# Altium project STAC_PCB.PrjPcb
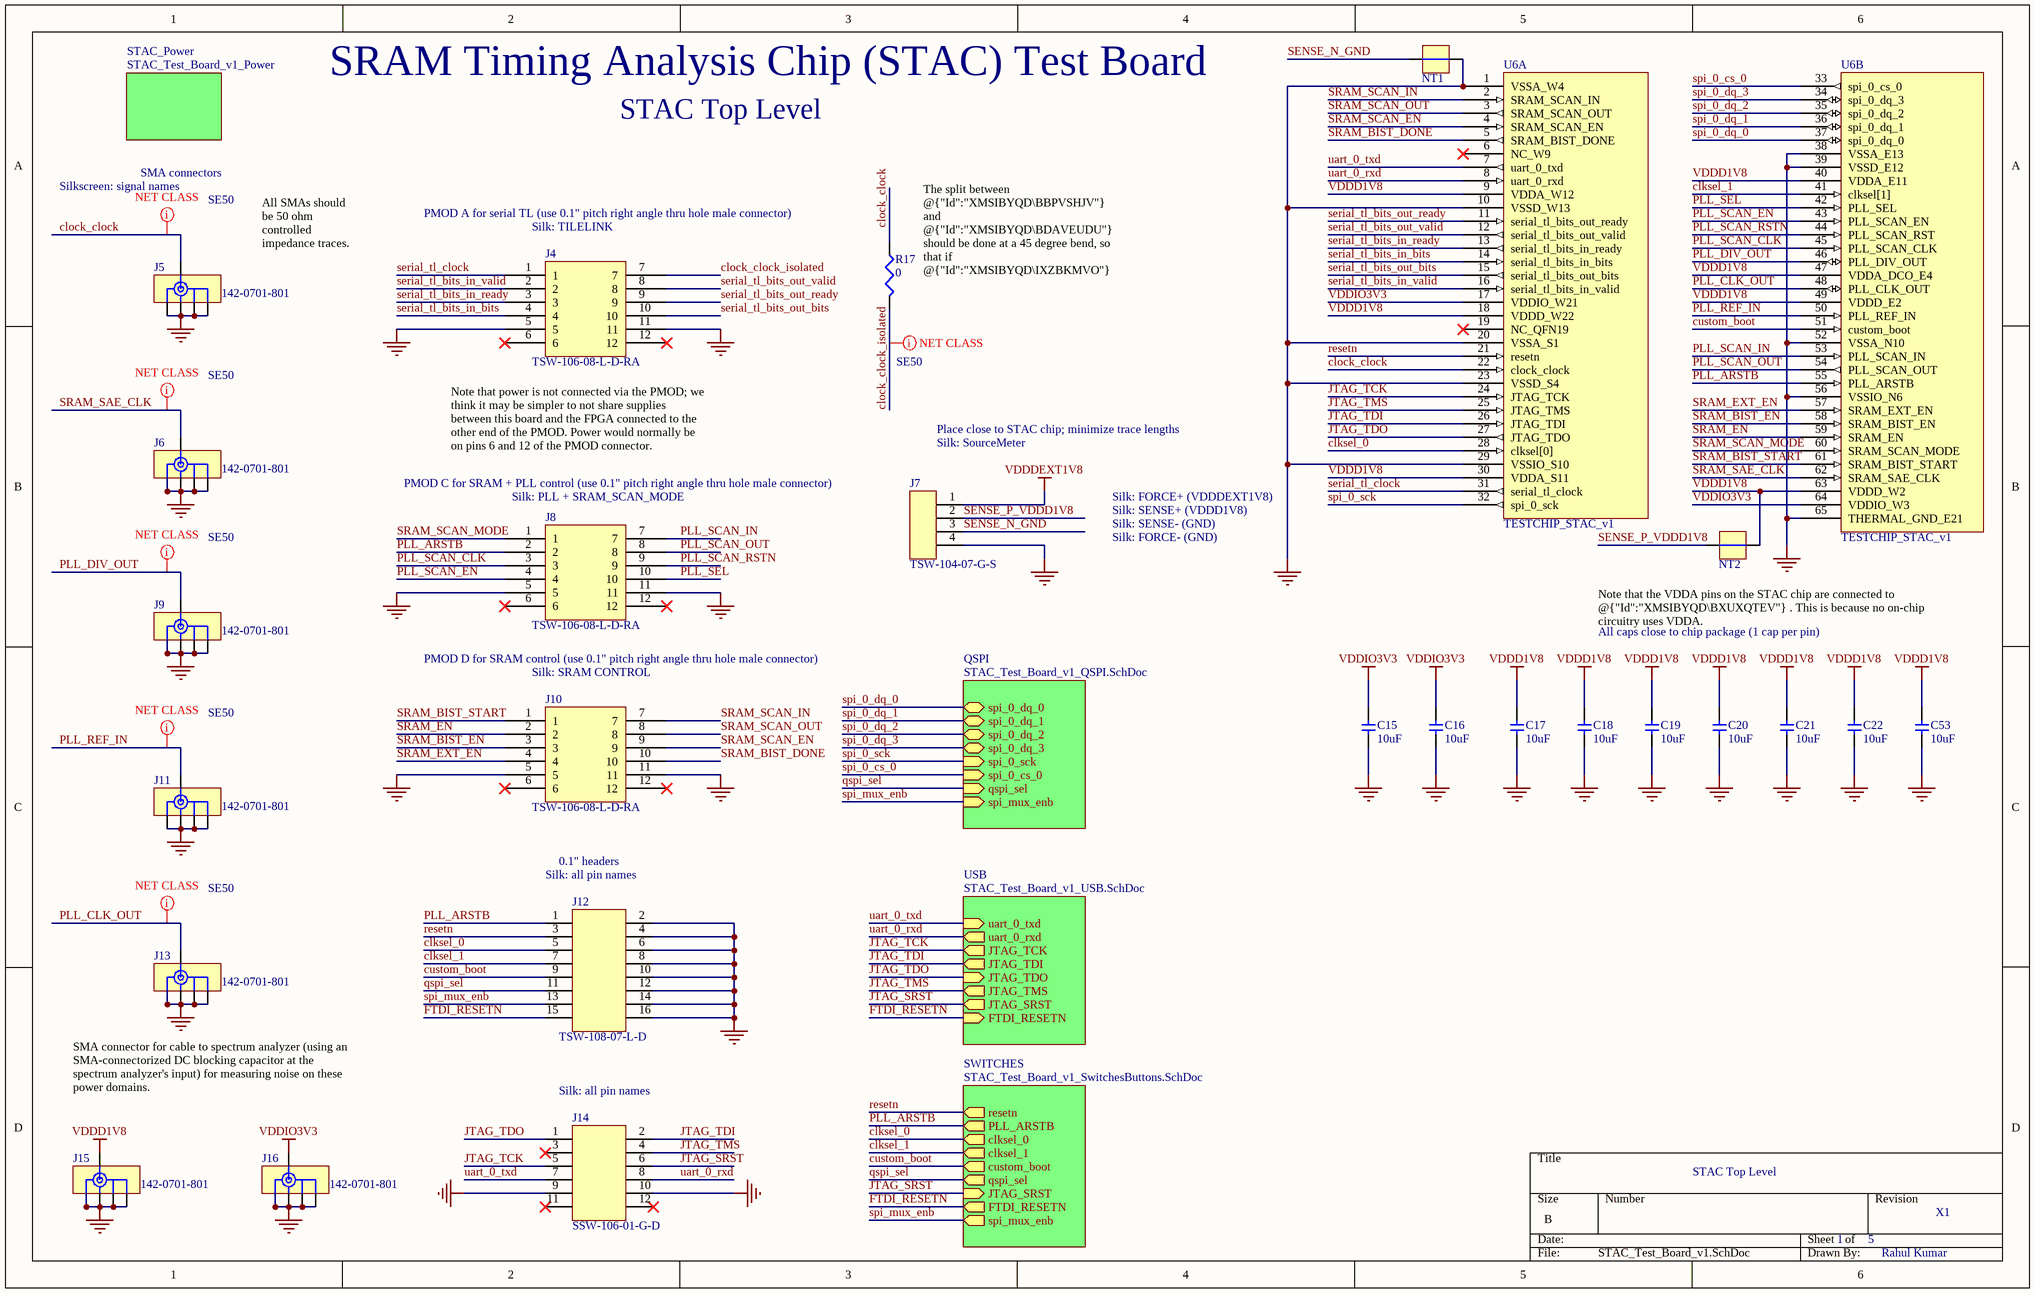
[diagram p0: STAC_Test_Board_v1.SchDoc]
5 sheets, 172 parts. Net scope: hierarchical (ports join the sheet entries above them; power ports are global).
Board file: STAC-v1-pcb.PcbDoc
Sheets:
  STAC_Test_Board_v1.SchDoc
    STAC_Power = STAC_Test_Board_v1_Power.SchDoc
    USB = STAC_Test_Board_v1_USB.SchDoc
    QSPI = STAC_Test_Board_v1_QSPI.SchDoc
    SWITCHES = STAC_Test_Board_v1_SwitchesButtons.SchDoc

## Sheet STAC_Test_Board_v1.SchDoc: STAC Top Level
size B; DrawnBy: Rahul Kumar; Revision: X1; SheetNumber: 1; SheetTotal: 5

### Parts
C15  10uF  [0603]
C16  10uF  [0603]
C17  10uF  [0603]
C18  10uF  [0603]
C19  10uF  [0603]
C20  10uF  [0603]
C21  10uF  [0603]
C22  10uF  [0603]
C53  10uF  [0603]
J4  TSW-106-08-L-D-RA  [CON-012-100-600X200/2X6-POST-RA_alt]
J5  142-0701-801  [CON-001-9.5X7.9/SMA-EDGE]
J6  142-0701-801  [CON-001-9.5X7.9/SMA-EDGE]
J7  TSW-104-07-G-S  [CON-004-100-400X100/1X4-POST]
J8  TSW-106-08-L-D-RA  [CON-012-100-600X200/2X6-POST-RA_alt]
J9  142-0701-801  [CON-001-9.5X7.9/SMA-EDGE]
J10  TSW-106-08-L-D-RA  [CON-012-100-600X200/2X6-POST-RA_alt]
J11  142-0701-801  [CON-001-9.5X7.9/SMA-EDGE]
J12  TSW-108-07-L-D  [CON-016-100-800X200/2X8-POST]
J13  142-0701-801  [CON-001-9.5X7.9/SMA-EDGE]
J14  SSW-106-01-G-D  [CON-012-100-600X200/2X6-POST]
J15  142-0701-801  [CON-001-9.5X7.9/SMA-EDGE]
J16  142-0701-801  [CON-001-9.5X7.9/SMA-EDGE]
NT1  DISCRETE_NetTie  [NET_TIE_ALT2_10MIL]  (value not drawn)  (net tie, no BOM)
NT2  DISCRETE_NetTie  [NET_TIE_ALT2_10MIL]  (value not drawn)  (net tie, no BOM)
R17  0  [0603]
U6  TESTCHIP_STAC_v1  [QFN-64-.5-9.0X9.0/THERM-7.6]  (parts A,B of 2)

### Sub-sheets
QSPI = STAC_Test_Board_v1_QSPI.SchDoc: spi_0_dq_0 (bidir), spi_0_dq_1 (bidir), spi_0_dq_2 (bidir), spi_0_dq_3 (bidir), spi_0_sck (in), spi_0_cs_0 (in), qspi_sel (in), spi_mux_enb (in)
STAC_Power = STAC_Test_Board_v1_Power: no entries
SWITCHES = STAC_Test_Board_v1_SwitchesButtons.SchDoc: resetn (out), PLL_ARSTB (out), clksel_0 (out), clksel_1 (out), custom_boot (out), qspi_sel (out), JTAG_SRST (in), FTDI_RESETN (out), spi_mux_enb (out)
USB = STAC_Test_Board_v1_USB.SchDoc: uart_0_txd (in), uart_0_rxd (out), JTAG_TCK (out), JTAG_TDI (out), JTAG_TDO (in), JTAG_TMS (out), JTAG_SRST (out), FTDI_RESETN (in)

### Nets
GND: C15.2 C16.2 C17.2 C18.2 C19.2 C20.2 C21.2 C22.2 C53.2 J4.5 J4.11 J5.2 J5.3 J5.4 J5.5 J6.2 J6.3 J6.4 J6.5 J7.4 J8.5 J8.11 J9.2 J9.3 J9.4 J9.5 J10.5 J10.11 J11.2 J11.3 J11.4 J11.5 J12.2 J12.4 J12.6 J12.8 J12.10 J12.12 J12.14 J12.16 J13.2 J13.3 J13.4 J13.5 J14.9 J14.10 J15.2 J15.3 J15.4 J15.5 J16.2 J16.3 J16.4 J16.5 NT1.2 U6.1(VSSA_W4) U6.10(VSSD_W13) U6.20(VSSA_S1) U6.23(VSSD_S4) U6.29(VSSIO_S10) U6.38(VSSA_E13) U6.39(VSSD_E12) U6.52(VSSA_N10) U6.56(VSSIO_N6) U6.65(THERMAL_GND_E21)
VDDD1V8: C17.1 C18.1 C19.1 C20.1 C21.1 C22.1 C53.1 J15.1 NT2.2 U6.9(VDDA_W12) U6.18(VDDD_W22) U6.30(VDDA_S11) U6.40(VDDA_E11) U6.47(VDDA_DCO_E4) U6.49(VDDD_E2) U6.63(VDDD_W2)
VDDDEXT1V8: J7.1
VDDIO3V3: C15.1 C16.1 J16.1 U6.17(VDDIO_W21) U6.64(VDDIO_W3)
clksel_0: J12.5 U6.28(clksel[0]) ; sheet SWITCHES/clksel_0
clksel_1: J12.7 U6.41(clksel[1]) ; sheet SWITCHES/clksel_1
clock_clock: J5.1 R17.1 U6.22(clock_clock)
clock_clock_isolated: J4.7 R17.2
custom_boot: J12.9 U6.51(custom_boot) ; sheet SWITCHES/custom_boot
FTDI_RESETN: J12.15 ; sheet USB/FTDI_RESETN, sheet SWITCHES/FTDI_RESETN
JTAG_SRST: J14.6 ; sheet USB/JTAG_SRST, sheet SWITCHES/JTAG_SRST
JTAG_TCK: J14.5 U6.24(JTAG_TCK) ; sheet USB/JTAG_TCK
JTAG_TDI: J14.2 U6.26(JTAG_TDI) ; sheet USB/JTAG_TDI
JTAG_TDO: J14.1 U6.27(JTAG_TDO) ; sheet USB/JTAG_TDO
JTAG_TMS: J14.4 U6.25(JTAG_TMS) ; sheet USB/JTAG_TMS
PLL_ARSTB: J8.2 J12.1 U6.55(PLL_ARSTB) ; sheet SWITCHES/PLL_ARSTB
PLL_CLK_OUT: J13.1 U6.48(PLL_CLK_OUT)
PLL_DIV_OUT: J9.1 U6.46(PLL_DIV_OUT)
PLL_REF_IN: J11.1 U6.50(PLL_REF_IN)
PLL_SCAN_CLK: J8.3 U6.45(PLL_SCAN_CLK)
PLL_SCAN_EN: J8.4 U6.43(PLL_SCAN_EN)
PLL_SCAN_IN: J8.7 U6.53(PLL_SCAN_IN)
PLL_SCAN_OUT: J8.8 U6.54(PLL_SCAN_OUT)
PLL_SCAN_RSTN: J8.9 U6.44(PLL_SCAN_RST)
PLL_SEL: J8.10 U6.42(PLL_SEL)
qspi_sel: J12.11 ; sheet QSPI/qspi_sel, sheet SWITCHES/qspi_sel
resetn: J12.3 U6.21(resetn) ; sheet SWITCHES/resetn
SENSE_N_GND: J7.3 NT1.1
SENSE_P_VDDD1V8: J7.2 NT2.1
serial_tl_bits_in_bits: J4.4 U6.14(serial_tl_bits_in_bits)
serial_tl_bits_in_ready: J4.3 U6.13(serial_tl_bits_in_ready)
serial_tl_bits_in_valid: J4.2 U6.16(serial_tl_bits_in_valid)
serial_tl_bits_out_bits: J4.10 U6.15(serial_tl_bits_out_bits)
serial_tl_bits_out_ready: J4.9 U6.11(serial_tl_bits_out_ready)
serial_tl_bits_out_valid: J4.8 U6.12(serial_tl_bits_out_valid)
serial_tl_clock: J4.1 U6.31(serial_tl_clock)
spi_0_cs_0: U6.33(spi_0_cs_0) ; sheet QSPI/spi_0_cs_0
spi_0_dq_0: U6.37(spi_0_dq_0) ; sheet QSPI/spi_0_dq_0
spi_0_dq_1: U6.36(spi_0_dq_1) ; sheet QSPI/spi_0_dq_1
spi_0_dq_2: U6.35(spi_0_dq_2) ; sheet QSPI/spi_0_dq_2
spi_0_dq_3: U6.34(spi_0_dq_3) ; sheet QSPI/spi_0_dq_3
spi_0_sck: U6.32(spi_0_sck) ; sheet QSPI/spi_0_sck
spi_mux_enb: J12.13 ; sheet QSPI/spi_mux_enb, sheet SWITCHES/spi_mux_enb
SRAM_BIST_DONE: J10.10 U6.5(SRAM_BIST_DONE)
SRAM_BIST_EN: J10.3 U6.58(SRAM_BIST_EN)
SRAM_BIST_START: J10.1 U6.61(SRAM_BIST_START)
SRAM_EN: J10.2 U6.59(SRAM_EN)
SRAM_EXT_EN: J10.4 U6.57(SRAM_EXT_EN)
SRAM_SAE_CLK: J6.1 U6.62(SRAM_SAE_CLK)
SRAM_SCAN_EN: J10.9 U6.4(SRAM_SCAN_EN)
SRAM_SCAN_IN: J10.7 U6.2(SRAM_SCAN_IN)
SRAM_SCAN_MODE: J8.1 U6.60(SRAM_SCAN_MODE)
SRAM_SCAN_OUT: J10.8 U6.3(SRAM_SCAN_OUT)
uart_0_rxd: J14.8 U6.8(uart_0_rxd) ; sheet USB/uart_0_rxd
uart_0_txd: J14.7 U6.7(uart_0_txd) ; sheet USB/uart_0_txd

Not connected (* = marked no-connect by the designer): J4 6* 12*; J8 6* 12*; J10 6* 12*; J14 3* 11* 12*; U6 6(NC_W9)* 19(NC_QFN19)*

### Layout directives
net class SE50: clock_clock, clock_clock_isolated, PLL_CLK_OUT, PLL_DIV_OUT, PLL_REF_IN, SRAM_SAE_CLK

### Notes on the sheet
- SRAM Timing Analysis Chip (STAC) Test Board
- Silkscreen: signal names
- SMA connectors
- PMOD A for serial TL (use 0.1" pitch right angle thru hole male connector)
- (near J4) Silk: TILELINK
- All SMAs should be 50 ohm controlled impedance traces.
- (near R17) The split between @{"Id":"XMSIBYQD\BBPVSHJV"} and @{"Id":"XMSIBYQD\BDAVEUDU"} should be done at a 45 degree bend, so that if @{"Id":"XMSIBYQD\IXZBKMVO"} is not placed, @{"Id":"XMSIBYQD\BBPVSHJV"} does not see any sharp bends.
- Place close to STAC chip; minimize trace lengths
- PMOD C for SRAM + PLL control (use 0.1" pitch right angle thru hole male connector)
- (near J4) Note that power is not connected via the PMOD; we think it may be simpler to not share supplies between this board and the FPGA connected to the other end of the PMOD. Power would normally be on pins 6 and 12 of the PMOD connector.
- (near J8) Silk: PLL + SRAM_SCAN_MODE
- Silk: SourceMeter
- Silk: FORCE+ (VDDDEXT1V8)
- Silk: SENSE+ (VDDD1V8)
- Silk: SENSE- (GND)
- Silk: FORCE- (GND)
- All caps close to chip package (1 cap per pin)
- (near NT2) Note that the VDDA pins on the STAC chip are connected to @{"Id":"XMSIBYQD\BXUXQTEV"} . This is because no on-chip circuitry uses VDDA.
- PMOD D for SRAM control (use 0.1" pitch right angle thru hole male connector)
- Silk: SRAM CONTROL
- (near J12) Silk: all pin names
- 0.1" headers
- SMA connector for cable to spectrum analyzer (using an SMA-connectorized DC blocking capacitor at the spectrum analyzer's input) for measuring noise on these power domains.
- (near J14) Silk: all pin names

### Library data of the parts
C15-C22 C53 = DISCRETE_C: Capacitor generic
J4 J8 J10 J14 = CON_012pin_2x6: Con 12 pins 2x6
J5 J6 J9 J11 J13 J15 J16 = CON_RF_SMA: Con RF SMA
J7 = CON_004pin_1x4: Con 4 pins 1x4
J12 = CON_016pin_2x8: Con 16 pins 2x8
NT1 NT2 = DISCRETE_NetTie: Net tie
R17 = DISCRETE_R: Resistor generic
U6 = TESTCHIP_STAC_v1: TESTCHIP STAC v1

## Sheet STAC_Test_Board_v1_Power.SchDoc: STAC Power Supplies and Regulators
size B; DrawnBy: Rahul Kumar; Revision: X1; SheetNumber: 2; SheetTotal: 5
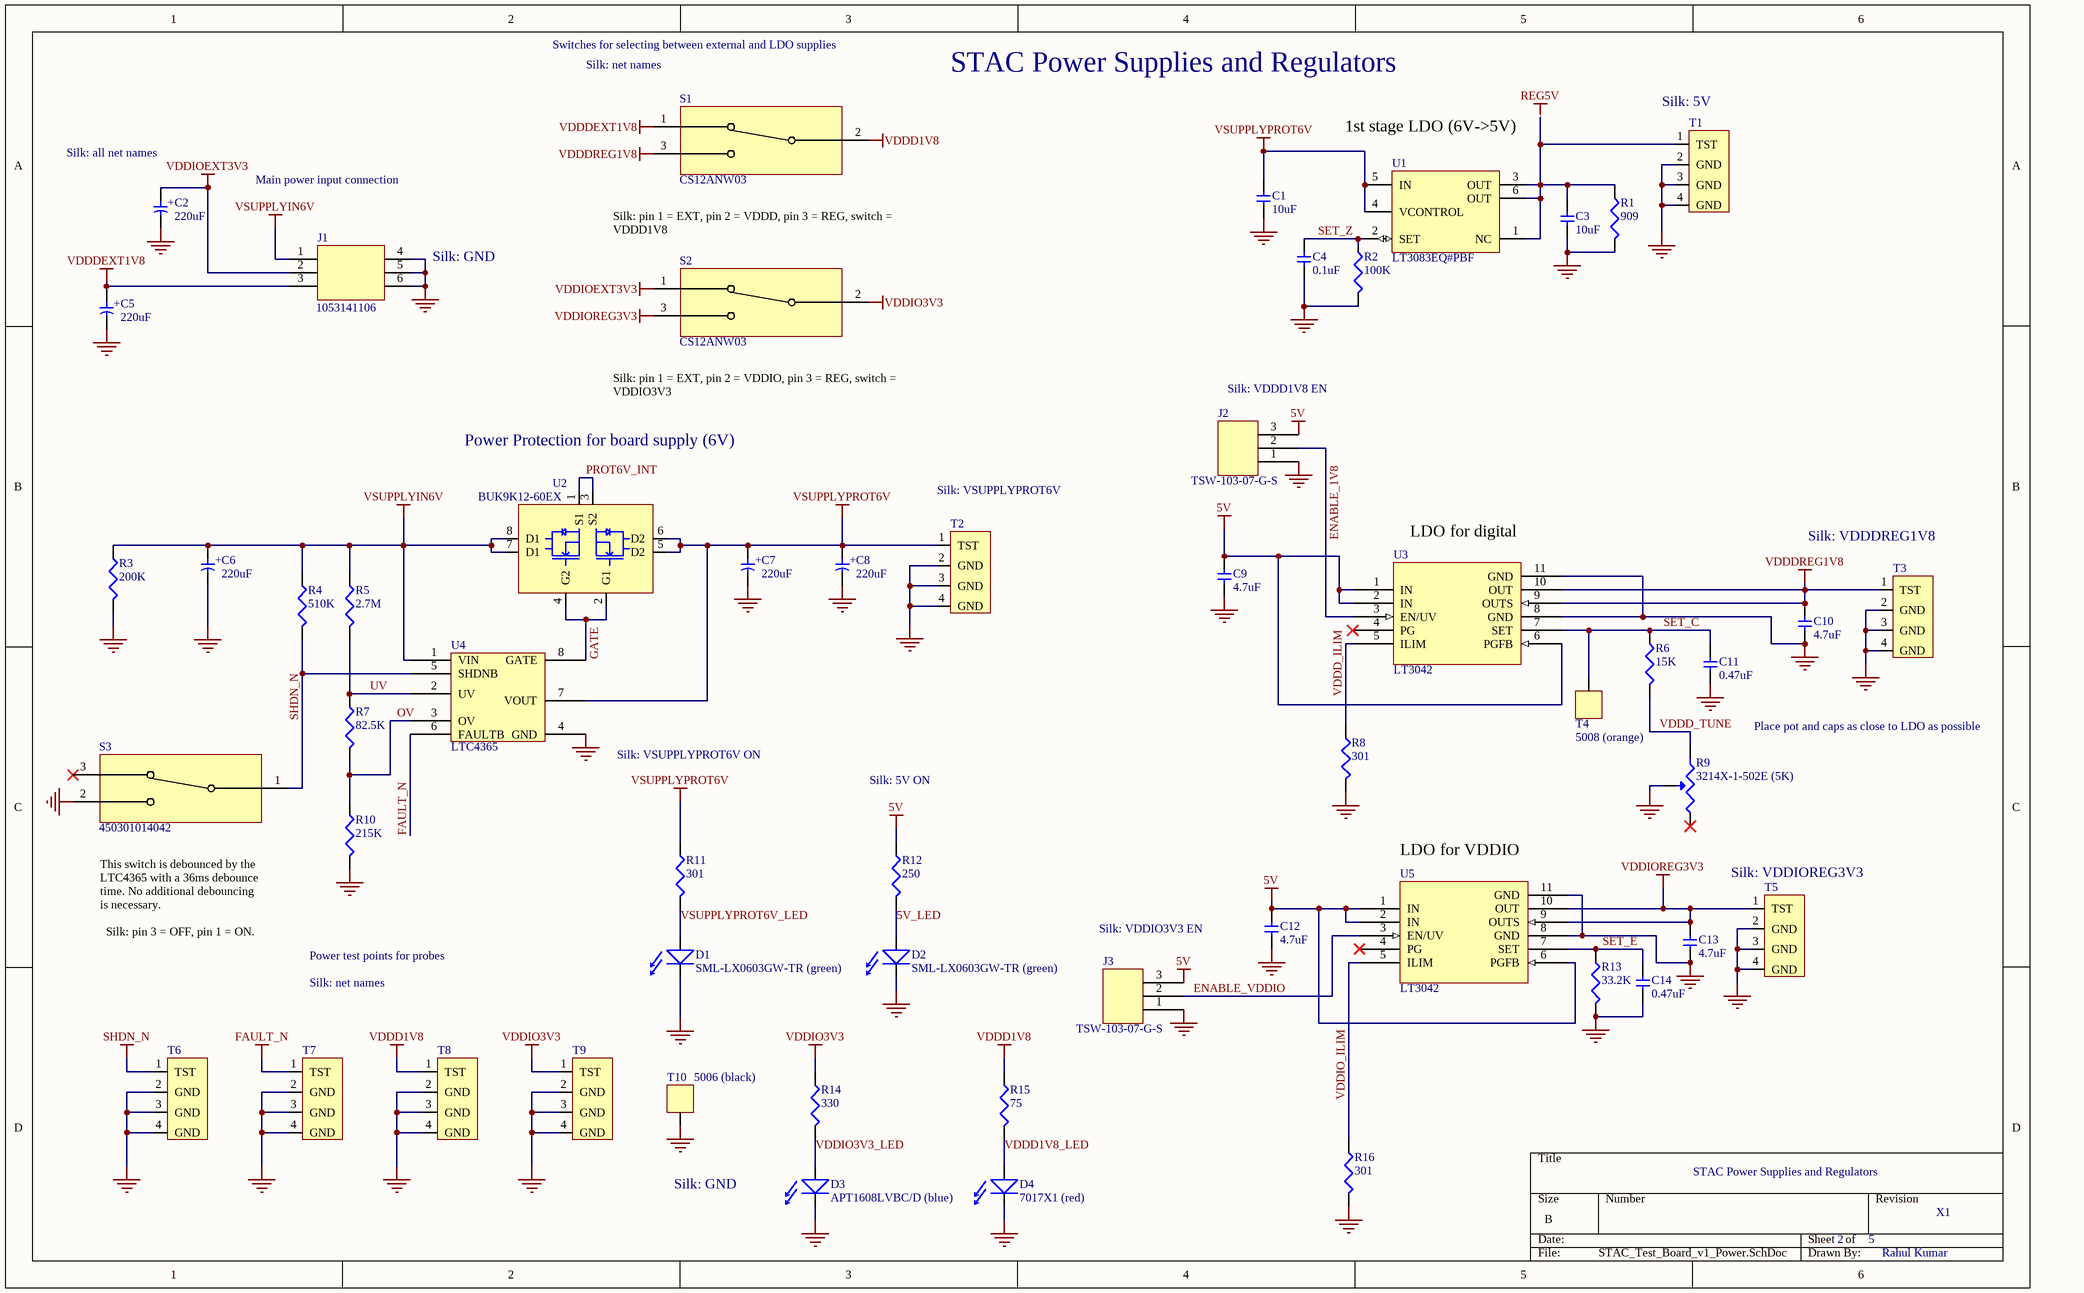
[diagram p1: STAC_Test_Board_v1_Power.SchDoc]

### Parts
C1  10uF  [0603]
C2  220uF  [CAP-SMT-CAN-D]
C3  10uF  [0603]
C4  0.1uF  [0603]
C5  220uF  [CAP-SMT-CAN-D]
C6  220uF  [CAP-SMT-CAN-D]
C7  220uF  [CAP-SMT-CAN-D]
C8  220uF  [CAP-SMT-CAN-D]
C9  4.7uF  [0603]
C10  4.7uF  [0603]
C11  0.47uF  [0603]
C12  4.7uF  [0603]
C13  4.7uF  [0603]
C14  0.47uF  [0603]
D1  SML-LX0603GW-TR (green)  [LED-0603]
D2  SML-LX0603GW-TR (green)  [LED-0603]
D3  APT1608LVBC/D (blue)  [LED-0603]
D4  7017X1 (red)  [LED-0603]
J1  1053141106  [CON-006-2.50-8.4X12.68/2X3-RA-POST]
J2  TSW-103-07-G-S  [CON-003-100-300X100/1X3-POST]
J3  TSW-103-07-G-S  [CON-003-100-300X100/1X3-POST]
R1  909  [0603]
R2  100K  [0603]
R3  200K  [0603]
R4  510K  [0603]
R5  2.7M  [0603]
R6  15K  [0603]
R7  82.5K  [0603]
R8  301  [0603]
R9  3214X-1-502E (5K)  [VR-03-100-4.8X5.7/TOP]
R10  215K  [0603]
R11  301  [0603]
R12  250  [0603]
R13  33.2K  [0603]
R14  330  [0603]
R15  75  [0603]
R16  301  [0603]
S1  CS12ANW03  [SW-003-4.7-14.0X7.0/SPDT-CS]
S2  CS12ANW03  [SW-003-4.7-14.0X7.0/SPDT-CS]
S3  450301014042  [SW-003-100-10.0X2.5/SPDT-WS-SLTV]
T1  TEST_PT_4  [TP-04-40/ROUND-THT]  (value not drawn)
T2  TEST_PT_4  [TP-04-40/ROUND-THT]  (value not drawn)
T3  TEST_PT_4  [TP-04-40/ROUND-THT]  (value not drawn)
T4  5008 (orange)  [TP-63/ROUND-THT]
T5  TEST_PT_4  [TP-04-40/ROUND-THT]  (value not drawn)
T6  TEST_PT_4  [TP-04-40/ROUND-THT]  (value not drawn)
T7  TEST_PT_4  [TP-04-40/ROUND-THT]  (value not drawn)
T8  TEST_PT_4  [TP-04-40/ROUND-THT]  (value not drawn)
T9  TEST_PT_4  [TP-04-40/ROUND-THT]  (value not drawn)
T10  5006 (black)  [TP-63/ROUND-THT]
U1  LT3083EQ#PBF  [TAB-05-10.2X14.2-Q-DDPAK]
U2  BUK9K12-60EX  [LCCT-08-1.27-5.3X6.2/DUAL-FET]
U3  LT3042  [GW-10-.5-4.9/THM]
U4  LTC4365  [GW-08-.65-2.9]
U5  LT3042  [GW-10-.5-4.9/THM]

### Nets
5V: C9.1 C12.1 J2.3 J3.3 R12.1 U3.1(IN) U3.2(IN) U3.6(PGFB) U5.1(IN) U5.2(IN) U5.6(PGFB)
FAULT_N: T7.1(TST) U4.6(FAULTB)
GND: C1.2 C2.2 C3.2 C4.2 C5.2 C6.2 C7.2 C8.2 C9.2 C10.2 C11.2 C12.2 C13.2 C14.2 D1.1 D2.1 D3.1 D4.1 J1.4 J1.5 J1.6 J2.1 J3.1 R1.2 R2.2 R3.2 R8.2 R9.2 R10.2 R13.2 R16.2 S3.2 T1.2(GND) T1.3(GND) T1.4(GND) T2.2(GND) T2.3(GND) T2.4(GND) T3.2(GND) T3.3(GND) T3.4(GND) T5.2(GND) T5.3(GND) T5.4(GND) T6.2(GND) T6.3(GND) T6.4(GND) T7.2(GND) T7.3(GND) T7.4(GND) T8.2(GND) T8.3(GND) T8.4(GND) T9.2(GND) T9.3(GND) T9.4(GND) T10.1 U3.8(GND) U3.11(GND) U4.4(GND) U5.8(GND) U5.11(GND)
REG5V: C3.1 R1.1 T1.1(TST) U1.1(NC) U1.3(OUT) U1.6(OUT)
SHDN_N: R4.2 S3.1 T6.1(TST) U4.5(SHDNB)
VDDD1V8: R15.1 S1.2 T8.1(TST)
VDDDEXT1V8: C5.1 J1.3 S1.1
VDDDREG1V8: C10.1 S1.3 T3.1(TST) U3.9(OUTS) U3.10(OUT)
VDDIO3V3: R14.1 S2.2 T9.1(TST)
VDDIOEXT3V3: C2.1 J1.2 S2.1
VDDIOREG3V3: C13.1 S2.3 T5.1(TST) U5.9(OUTS) U5.10(OUT)
VSUPPLYIN6V: C6.1 J1.1 R3.1 R4.1 R5.1 U2.7(D1) U2.8(D1) U4.1(VIN)
VSUPPLYPROT6V: C1.1 C7.1 C8.1 R11.1 T2.1(TST) U1.4(VCONTROL) U1.5(IN) U2.5(D2) U2.6(D2) U4.7(VOUT)
5V_LED: D2.2 R12.2
ENABLE_1V8: J2.2 U3.3(EN/UV)
ENABLE_VDDIO: J3.2 U5.3(EN/UV)
GATE: U2.2(G1) U2.4(G2) U4.8(GATE)
OV: R7.2 R10.1 U4.3(OV)
PROT6V_INT: U2.1(S1) U2.3(S2)
SET_C: C11.1 R6.1 T4.1 U3.7(SET)
SET_E: C14.1 R13.1 U5.7(SET)
SET_Z: C4.1 R2.1 U1.2(SET)
UV: R5.2 R7.1 U4.2(UV)
VDDD1V8_LED: D4.2 R15.2
VDDD_ILIM: R8.1 U3.5(ILIM)
VDDD_TUNE: R6.2 R9.3
VDDIO3V3_LED: D3.2 R14.2
VDDIO_ILIM: R16.1 U5.5(ILIM)
VSUPPLYPROT6V_LED: D1.2 R11.2

Not connected (* = marked no-connect by the designer): R9 1*; S3 3*; U3 4(PG)*; U5 4(PG)*

### Notes on the sheet
- Switches for selecting between external and LDO supplies
- Silk: net names
- (near C2) Silk: all net names
- (near U1) 1st stage LDO (6V->5V)
- (near T1) Silk: 5V
- Main power input connection
- (near J1) Silk: GND
- Silk: pin 1 = EXT, pin 2 = VDDD, pin 3 = REG, switch = VDDD1V8
- Silk: pin 1 = EXT, pin 2 = VDDIO, pin 3 = REG, switch = VDDIO3V3
- (near J2) Silk: VDDD1V8 EN
- Power Protection for board supply (6V)
- (near T2) Silk: VSUPPLYPROT6V
- (near U3) LDO for digital
- (near T3) Silk: VDDDREG1V8
- Silk: VSUPPLYPROT6V ON
- Place pot and caps as close to LDO as possible
- Silk: 5V ON
- This switch is debounced by the LTC4365 with a 36ms debounce time. No additional debouncing is necessary.
- (near U5) LDO for VDDIO
- (near T5) Silk: VDDIOREG3V3
- Silk: pin 3 = OFF, pin 1 = ON.
- Power test points for probes
- Silk: VDDIO3V3 EN
- Silk: GND
- (in symbol DISCRETE_C_POL) +

### Library data of the parts
C1 C3 C4 C9-C14 = DISCRETE_C: Capacitor generic
C2 C5-C8 = DISCRETE_C_POL: 20% 16V Alum Radial SMD
D1-D4 = DISCRETE_LED: LED generic
J1 = CON_006pin_2x3_alt: Con 6 pins 2x3
J2 J3 = CON_003pin_1x3: Con 3 pins
R1-R8 R10-R16 = DISCRETE_R: Resistor generic
R9 = DISCRETE_R_VARIABLE: Potentiometer
S1 S2 = SWITCH_SPDT_3pin: SWITCH SLIDE SPDT
S3 = SWITCH_SPDT_3pin_alt: SWITCH SLIDE SPDT alternative symbol
T1-T3 T5-T9 = TEST_PT_4: Test point 4 pads for probing
T4 T10 = TEST_PT: Test point 1 pin
U1 = IC_LT3083: 3 A Single Resistor LDO 1.2 to 23 V Vin, Adj Vout
U2 = IC_BUK9K12-60EX: Dual channel NMOS FETs
U3 U5 = IC_LT3042: LT3042 ultralow noise, high PSRR LDO, max current 200mA
U4 = IC_LTC4365: LTC4365 Over/Under Voltage, Reverse Supply Protection Controller

## Sheet STAC_Test_Board_v1_USB.SchDoc: STAC USB to UART/JTAG
size B; DrawnBy: Rahul Kumar; Revision: X1; SheetNumber: 3; SheetTotal: 5
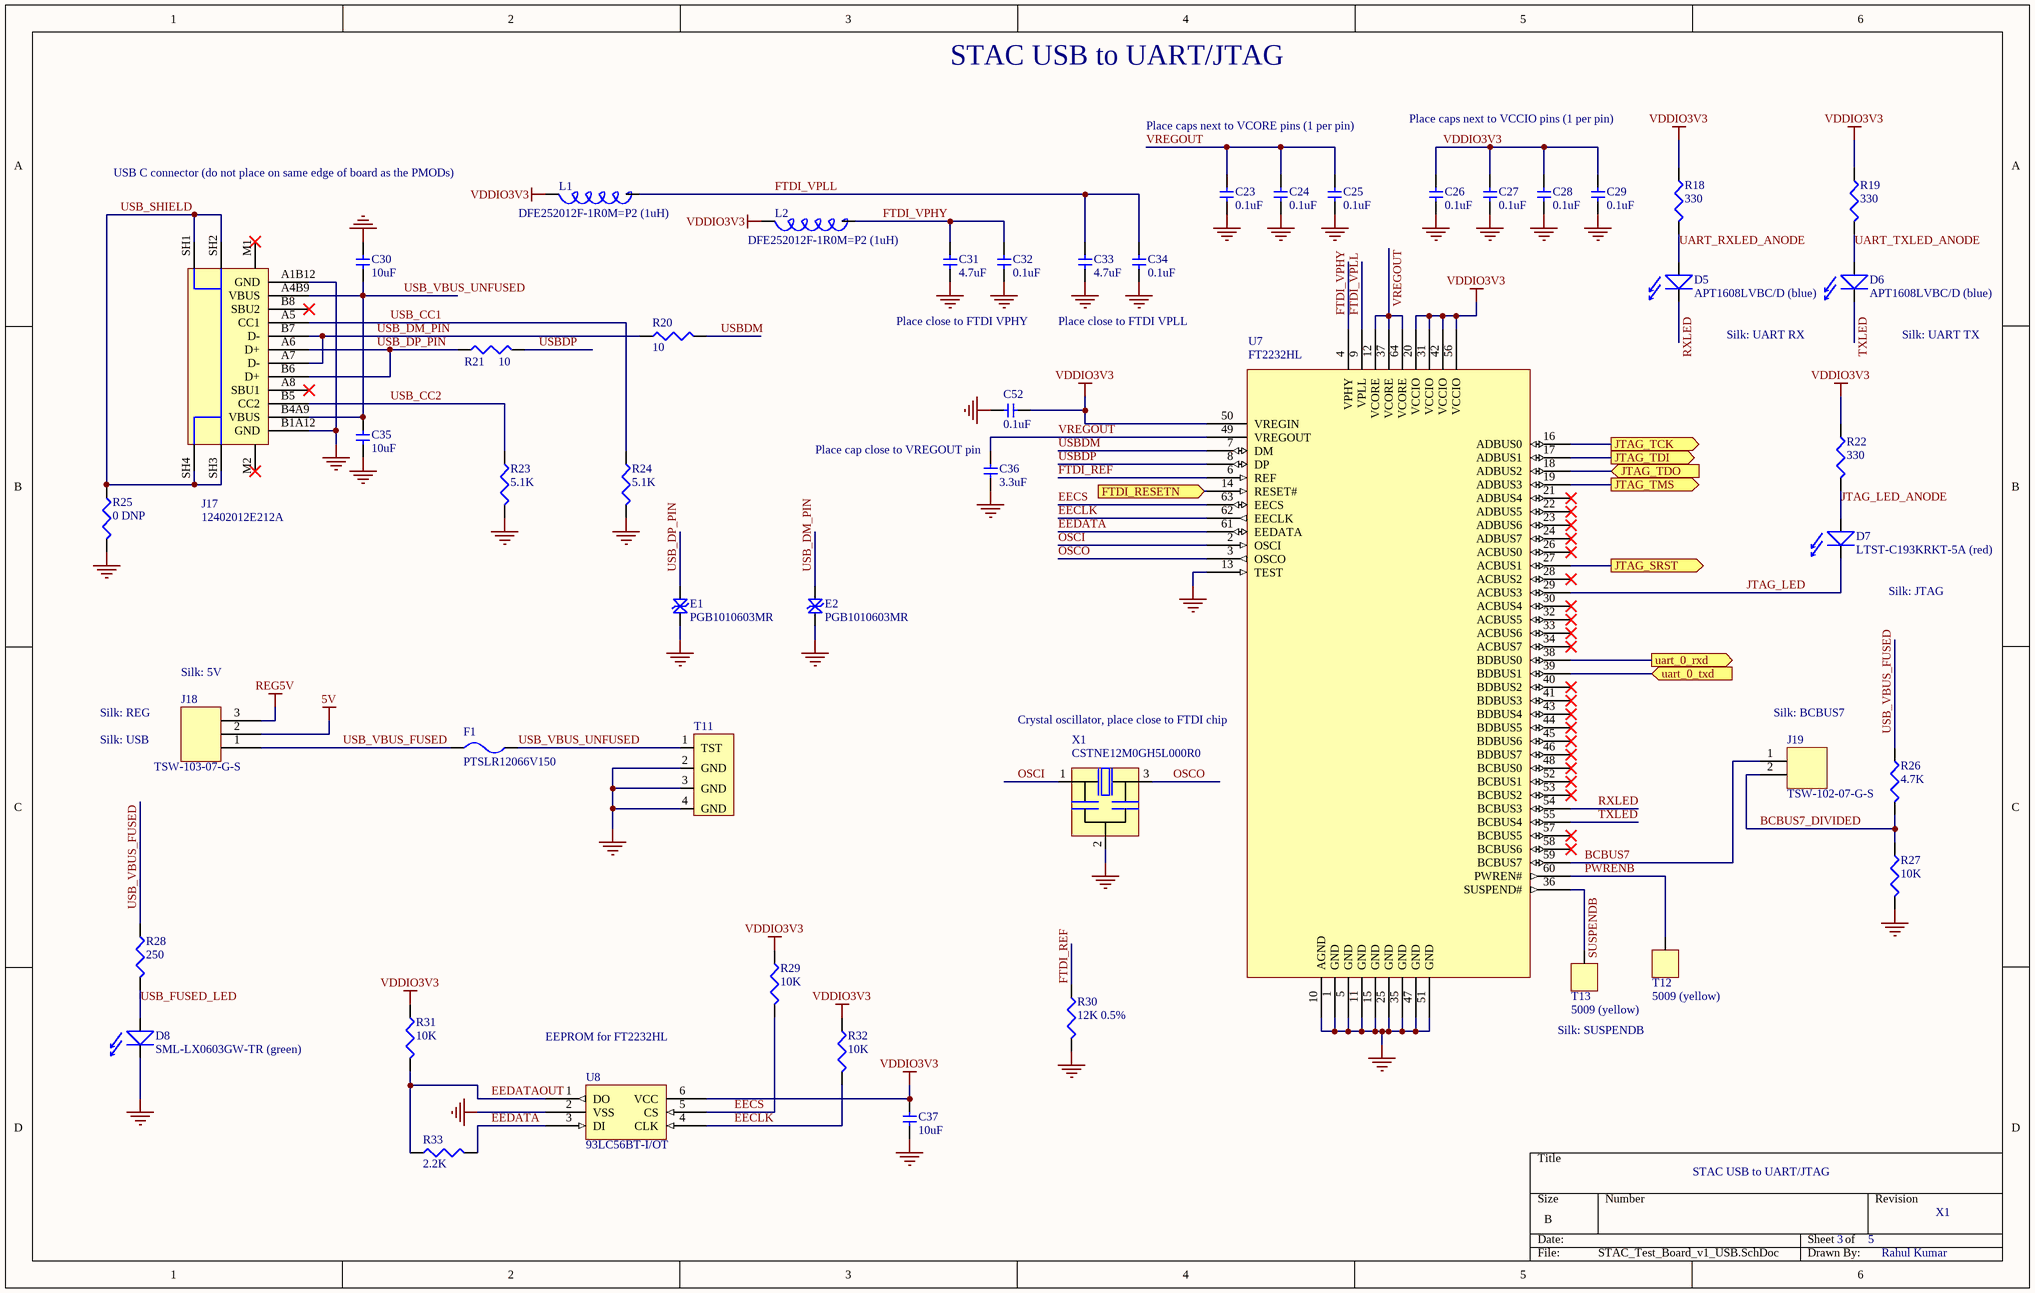
[diagram p2: STAC_Test_Board_v1_USB.SchDoc]

### Parts
C23  0.1uF  [0603]
C24  0.1uF  [0603]
C25  0.1uF  [0603]
C26  0.1uF  [0603]
C27  0.1uF  [0603]
C28  0.1uF  [0603]
C29  0.1uF  [0603]
C30  10uF  [0603]
C31  4.7uF  [0603]
C32  0.1uF  [0603]
C33  4.7uF  [0603]
C34  0.1uF  [0603]
C35  10uF  [0603]
C36  3.3uF  [0603]
C37  10uF  [0603]
C52  0.1uF  [0603]
D5  APT1608LVBC/D (blue)  [LED-0603]
D6  APT1608LVBC/D (blue)  [LED-0603]
D7  LTST-C193KRKT-5A (red)  [LED-0603]
D8  SML-LX0603GW-TR (green)  [LED-0603]
E1  PGB1010603MR  [0603]
E2  PGB1010603MR  [0603]
F1  PTSLR12066V150  [1206]
J17  12402012E212A  [CON-012-0.5-8.90X7.4/USB-C]
J18  TSW-103-07-G-S  [CON-003-100-300X100/1X3-POST]
J19  TSW-102-07-G-S  [CON-002-100-200X100/1X2-POST]
L1  DFE252012F-1R0M=P2 (1uH)  [1008]
L2  DFE252012F-1R0M=P2 (1uH)  [1008]
R18  330  [0603]
R19  330  [0603]
R20  10  [0603]
R21  10  [0603]
R22  330  [0603]
R23  5.1K  [0603]
R24  5.1K  [0603]
R25  0 DNP  [0603]
R26  4.7K  [0603]
R27  10K  [0603]
R28  250  [0603]
R29  10K  [0603]
R30  12K 0.5%  [0603]
R31  10K  [0603]
R32  10K  [0603]
R33  2.2K  [0603]
T11  TEST_PT_4  [TP-04-40/ROUND-THT]  (value not drawn)
T12  5009 (yellow)  [TP-63/ROUND-THT]
T13  5009 (yellow)  [TP-63/ROUND-THT]
U7  FT2232HL  [QFP-64-.5-12.0X12.0]
U8  93LC56BT-I/OT  [SOT-23-6]
X1  CSTNE12M0GH5L000R0  [XTAL-03-1.2-3.2X1.3/MURATA]

### Ports
FTDI_RESETN (in, see STAC_Test_Board_v1[3D], STAC_Test_Board_v1_SwitchesButtons[6D]), JTAG_SRST (out, see STAC_Test_Board_v1[3D], STAC_Test_Board_v1_SwitchesButtons[2B]), JTAG_TCK (out, see STAC_Test_Board_v1[3C]), JTAG_TDI (out, see STAC_Test_Board_v1[3C]), JTAG_TDO (in, see STAC_Test_Board_v1[3D]), JTAG_TMS (out, see STAC_Test_Board_v1[3D]), uart_0_rxd (out, see STAC_Test_Board_v1[3C]), uart_0_txd (in, see STAC_Test_Board_v1[3C])

### Nets
5V: J18.2
GND: C23.2 C24.2 C25.2 C26.2 C27.2 C28.2 C29.2 C30.1 C31.2 C32.2 C33.2 C34.2 C35.2 C36.2 C37.2 C52.1 D8.1 E1.2 E2.2 J17.A1B12(GND) J17.B1A12(GND) R23.2 R24.2 R25.2 R27.2 R30.2 T11.2(GND) T11.3(GND) T11.4(GND) U7.1(GND) U7.5(GND) U7.10(AGND) U7.11(GND) U7.13(TEST) U7.15(GND) U7.25(GND) U7.35(GND) U7.47(GND) U7.51(GND) U8.2(VSS) X1.2(GND)
REG5V: J18.3
VDDIO3V3: C26.1 C27.1 C28.1 C29.1 C37.1 C52.2 L1.2 L2.2 R18.1 R19.1 R22.1 R29.1 R31.1 R32.1 U7.20(VCCIO) U7.31(VCCIO) U7.42(VCCIO) U7.50(VREGIN) U7.56(VCCIO) U8.6(VCC)
BCBUS7: J19.1 U7.59(BCBUS7)
BCBUS7_DIVIDED: J19.2 R26.2 R27.1
EECLK: R32.2 U7.62(EECLK) U8.4(CLK)
EECS: R29.2 U7.63(EECS) U8.5(CS)
EEDATA: R33.2 U7.61(EEDATA) U8.3(DI)
EEDATAOUT: R31.2 R33.1 U8.1(DO)
FTDI_REF: R30.1 U7.6(REF)
FTDI_RESETN: U7.14(RESET#) ; port FTDI_RESETN
FTDI_VPHY: C31.1 C32.1 L2.1 U7.4(VPHY)
FTDI_VPLL: C33.1 C34.1 L1.1 U7.9(VPLL)
JTAG_LED: D7.1 U7.29(ACBUS3)
JTAG_LED_ANODE: D7.2 R22.2
JTAG_SRST: U7.27(ACBUS1) ; port JTAG_SRST
JTAG_TCK: U7.16(ADBUS0) ; port JTAG_TCK
JTAG_TDI: U7.17(ADBUS1) ; port JTAG_TDI
JTAG_TDO: U7.18(ADBUS2) ; port JTAG_TDO
JTAG_TMS: U7.19(ADBUS3) ; port JTAG_TMS
OSCI: U7.2(OSCI) X1.1(INPUT)
OSCO: U7.3(OSCO) X1.3(OUTPUT)
PWRENB: T12.1 U7.60(PWREN#)
RXLED: D5.1 U7.54(BCBUS3)
SUSPENDB: T13.1 U7.36(SUSPEND#)
TXLED: D6.1 U7.55(BCBUS4)
uart_0_rxd: U7.38(BDBUS0) ; port uart_0_rxd
uart_0_txd: U7.39(BDBUS1) ; port uart_0_txd
UART_RXLED_ANODE: D5.2 R18.2
UART_TXLED_ANODE: D6.2 R19.2
USB_CC1: J17.A5(CC1) R24.1
USB_CC2: J17.B5(CC2) R23.1
USB_DM_PIN: E2.1 J17.A7(D-) J17.B7(D-) R20.1
USB_DP_PIN: E1.1 J17.A6(D+) J17.B6(D+) R21.1
USB_FUSED_LED: D8.2 R28.2
USB_SHIELD: J17.SH1 J17.SH2 J17.SH3 J17.SH4 R25.1
USB_VBUS_FUSED: F1.2 J18.1 R26.1 R28.1
USB_VBUS_UNFUSED: C30.2 C35.1 F1.1 J17.A4B9(VBUS) J17.B4A9(VBUS) T11.1(TST)
USBDM: R20.2 U7.7(DM)
USBDP: R21.2 U7.8(DP)
VREGOUT: C23.1 C24.1 C25.1 C36.1 U7.12(VCORE) U7.37(VCORE) U7.49(VREGOUT) U7.64(VCORE)

Not connected (* = marked no-connect by the designer): J17 A8(SBU1)* B8(SBU2)* M1* M2*; U7 21(ADBUS4)* 22(ADBUS5)* 23(ADBUS6)* 24(ADBUS7)* 26(ACBUS0)* 28(ACBUS2)* 30(ACBUS4)* 32(ACBUS5)* 33(ACBUS6)* 34(ACBUS7)* 40(BDBUS2)* 41(BDBUS3)* 43(BDBUS4)* 44(BDBUS5)* 45(BDBUS6)* 46(BDBUS7)* 48(BCBUS0)* 52(BCBUS1)* 53(BCBUS2)* 57(BCBUS5)* 58(BCBUS6)*

### Notes on the sheet
- Place caps next to VCORE pins (1 per pin)
- Place caps next to VCCIO pins (1 per pin)
- USB C connector (do not place on same edge of board as the PMODs)
- Place close to FTDI VPHY
- Place close to FTDI VPLL
- Silk: UART RX
- Silk: UART TX
- (near C36) Place cap close to VREGOUT pin
- Silk: JTAG
- (near J18) Silk: 5V
- Silk: REG
- Silk: USB
- (near U7) Crystal oscillator, place close to FTDI chip
- Silk: BCBUS7
- EEPROM for FT2232HL
- Silk: SUSPENDB

### Library data of the parts
C23-C37 C52 = DISCRETE_C: Capacitor generic
D5-D8 = DISCRETE_LED: LED generic
E1 E2 = DISCRETE_TVS: TVS ESD protection clamp generic
F1 = DISCRETE_F: Fuse generic
J17 = CON_012pin_USB_C_RECP: Con 12 pin USB C receptacle + 4 shields, and 2 alignment posts
J18 = CON_003pin_1x3: Con 3 pins
J19 = CON_002pin_1x2: Con 2 pins
L1 L2 = DISCRETE_L: Inductor generic
R18-R22 R25-R33 = DISCRETE_R: Resistor generic
R23 R24 = DISCRETE_R: 5.1kohm resistor
T11 = TEST_PT_4: Test point 4 pads for probing
T12 T13 = TEST_PT: Test point 1 pin
U7 = IC_FT2232HL: USB Hi-Speed to Dual Channel Serial UART/FIFO/JTAG/SPI/I2C IC 64-pin LQFP package
U8 = IC_93LC56BT-I/OT: EEPROM Non-Volatile Memory 2kbit 128x16 2MHz 2.5V-5.5V SOT-23-6
X1 = XTALOSC_CAP: crystal oscillator with internal loading capacitors, 3 pins (input, GND, output)

## Sheet STAC_Test_Board_v1_QSPI.SchDoc: STAC Quad-SPI Peripherals
size B; DrawnBy: Rahul Kumar; Revision: X1; SheetNumber: 4; SheetTotal: 5
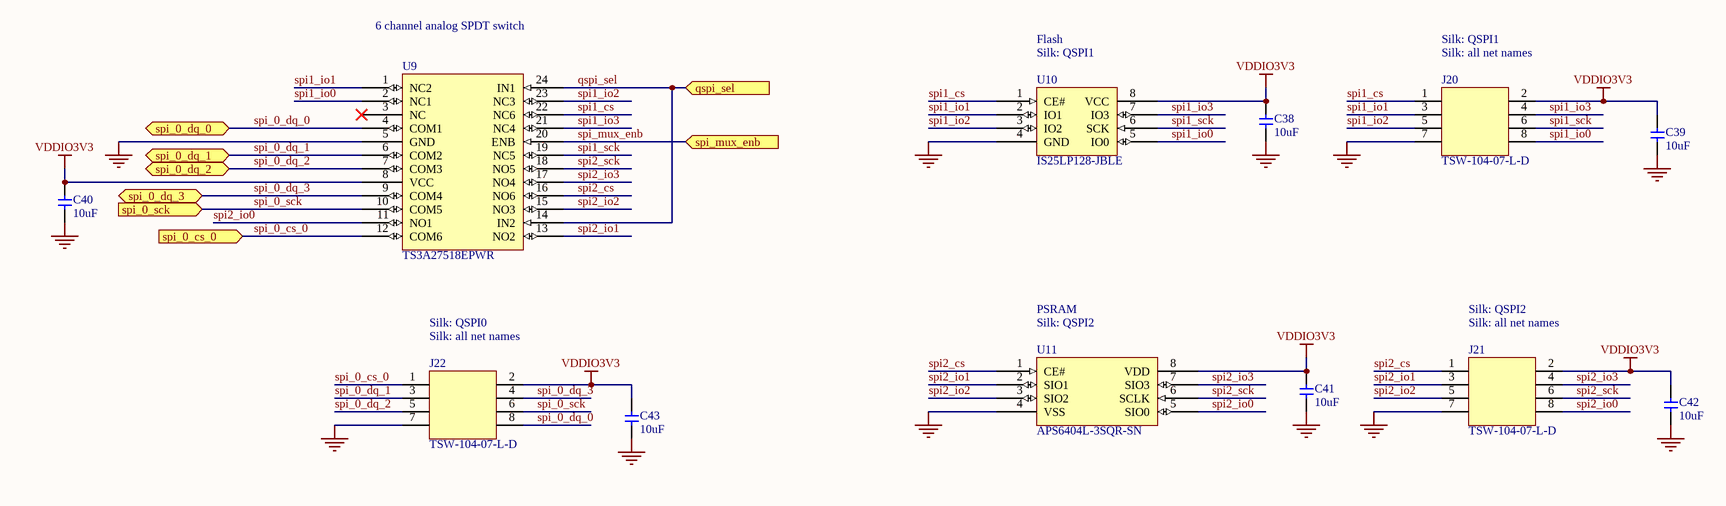
[diagram p3: STAC_Test_Board_v1_QSPI.SchDoc]

### Parts
C38  10uF  [0603]
C39  10uF  [0603]
C40  10uF  [0603]
C41  10uF  [0603]
C42  10uF  [0603]
C43  10uF  [0603]
J20  TSW-104-07-L-D  [CON-008-100-400X200/2X4-POST]
J21  TSW-104-07-L-D  [CON-008-100-400X200/2X4-POST]
J22  TSW-104-07-L-D  [CON-008-100-400X200/2X4-POST]
U9  TS3A27518EPWR  [GW-24-.65-6.4]
U10  IS25LP128-JBLE  [GW-08-1.27-5.2X8.0]
U11  APS6404L-3SQR-SN  [GW-08-1.27-5.0X6.0]

### Ports
qspi_sel (in, see STAC_Test_Board_v1[3C], STAC_Test_Board_v1_SwitchesButtons[6C]), spi_0_cs_0 (in, see STAC_Test_Board_v1[3C]), spi_0_dq_0 (bidir, see STAC_Test_Board_v1[3C]), spi_0_dq_1 (bidir, see STAC_Test_Board_v1[3C]), spi_0_dq_2 (bidir, see STAC_Test_Board_v1[3C]), spi_0_dq_3 (bidir, see STAC_Test_Board_v1[3C]), spi_0_sck (in, see STAC_Test_Board_v1[3C]), spi_mux_enb (in, see STAC_Test_Board_v1[3C], STAC_Test_Board_v1_SwitchesButtons[6C])

### Nets
GND: C38.2 C39.2 C40.2 C41.2 C42.2 C43.2 J20.7 J21.7 J22.7 U9.5(GND) U10.4(GND) U11.4(VSS)
VDDIO3V3: C38.1 C39.1 C40.1 C41.1 C42.1 C43.1 J20.2 J21.2 J22.2 U9.8(VCC) U10.8(VCC) U11.8(VDD)
qspi_sel: U9.14(IN2) U9.24(IN1) ; port qspi_sel
spi1_cs: J20.1 U9.22(NC6) U10.1(CE#)
spi1_io0: J20.8 U9.2(NC1) U10.5(IO0)
spi1_io1: J20.3 U9.1(NC2) U10.2(IO1)
spi1_io2: J20.5 U9.23(NC3) U10.3(IO2)
spi1_io3: J20.4 U9.21(NC4) U10.7(IO3)
spi1_sck: J20.6 U9.19(NC5) U10.6(SCK)
spi2_cs: J21.1 U9.16(NO6) U11.1(CE#)
spi2_io0: J21.8 U9.11(NO1) U11.5(SIO0)
spi2_io1: J21.3 U9.13(NO2) U11.2(SIO1)
spi2_io2: J21.5 U9.15(NO3) U11.3(SIO2)
spi2_io3: J21.4 U9.17(NO4) U11.7(SIO3)
spi2_sck: J21.6 U9.18(NO5) U11.6(SCLK)
spi_0_cs_0: J22.1 U9.12(COM6) ; port spi_0_cs_0
spi_0_dq_0: J22.8 U9.4(COM1) ; port spi_0_dq_0
spi_0_dq_1: J22.3 U9.6(COM2) ; port spi_0_dq_1
spi_0_dq_2: J22.5 U9.7(COM3) ; port spi_0_dq_2
spi_0_dq_3: J22.4 U9.9(COM4) ; port spi_0_dq_3
spi_0_sck: J22.6 U9.10(COM5) ; port spi_0_sck
spi_mux_enb: U9.20(ENB) ; port spi_mux_enb

Not connected (* = marked no-connect by the designer): U9 3(NC)*

### Notes on the sheet
- 6 channel analog SPDT switch
- Flash
- (near U10) Silk: QSPI1
- Silk: QSPI1
- (near J20) Silk: all net names
- Silk: QSPI0
- PSRAM
- (near U11) Silk: QSPI2
- Silk: QSPI2
- (near J21) Silk: all net names
- (near J22) Silk: all net names

### Library data of the parts
C38-C43 = DISCRETE_C: Capacitor generic
J20-J22 = CON_008pin_2x4: Con 8 pins 2x4
U9 = IC_TS3A27518EPWR: Analog switch SPDT 6 channels bidirectional
U10 = IC_IS25LP128: Flash memory 128Mb with 133MHz QSPI
U11 = IC_APS6404L: PSRAM 64Mb with 84-133MHz QSPI, 1024 byte pages

## Sheet STAC_Test_Board_v1_SwitchesButtons.SchDoc: STAC User Switches and Buttons
size B; DrawnBy: Rahul Kumar; Revision: X1; SheetNumber: 5; SheetTotal: 5
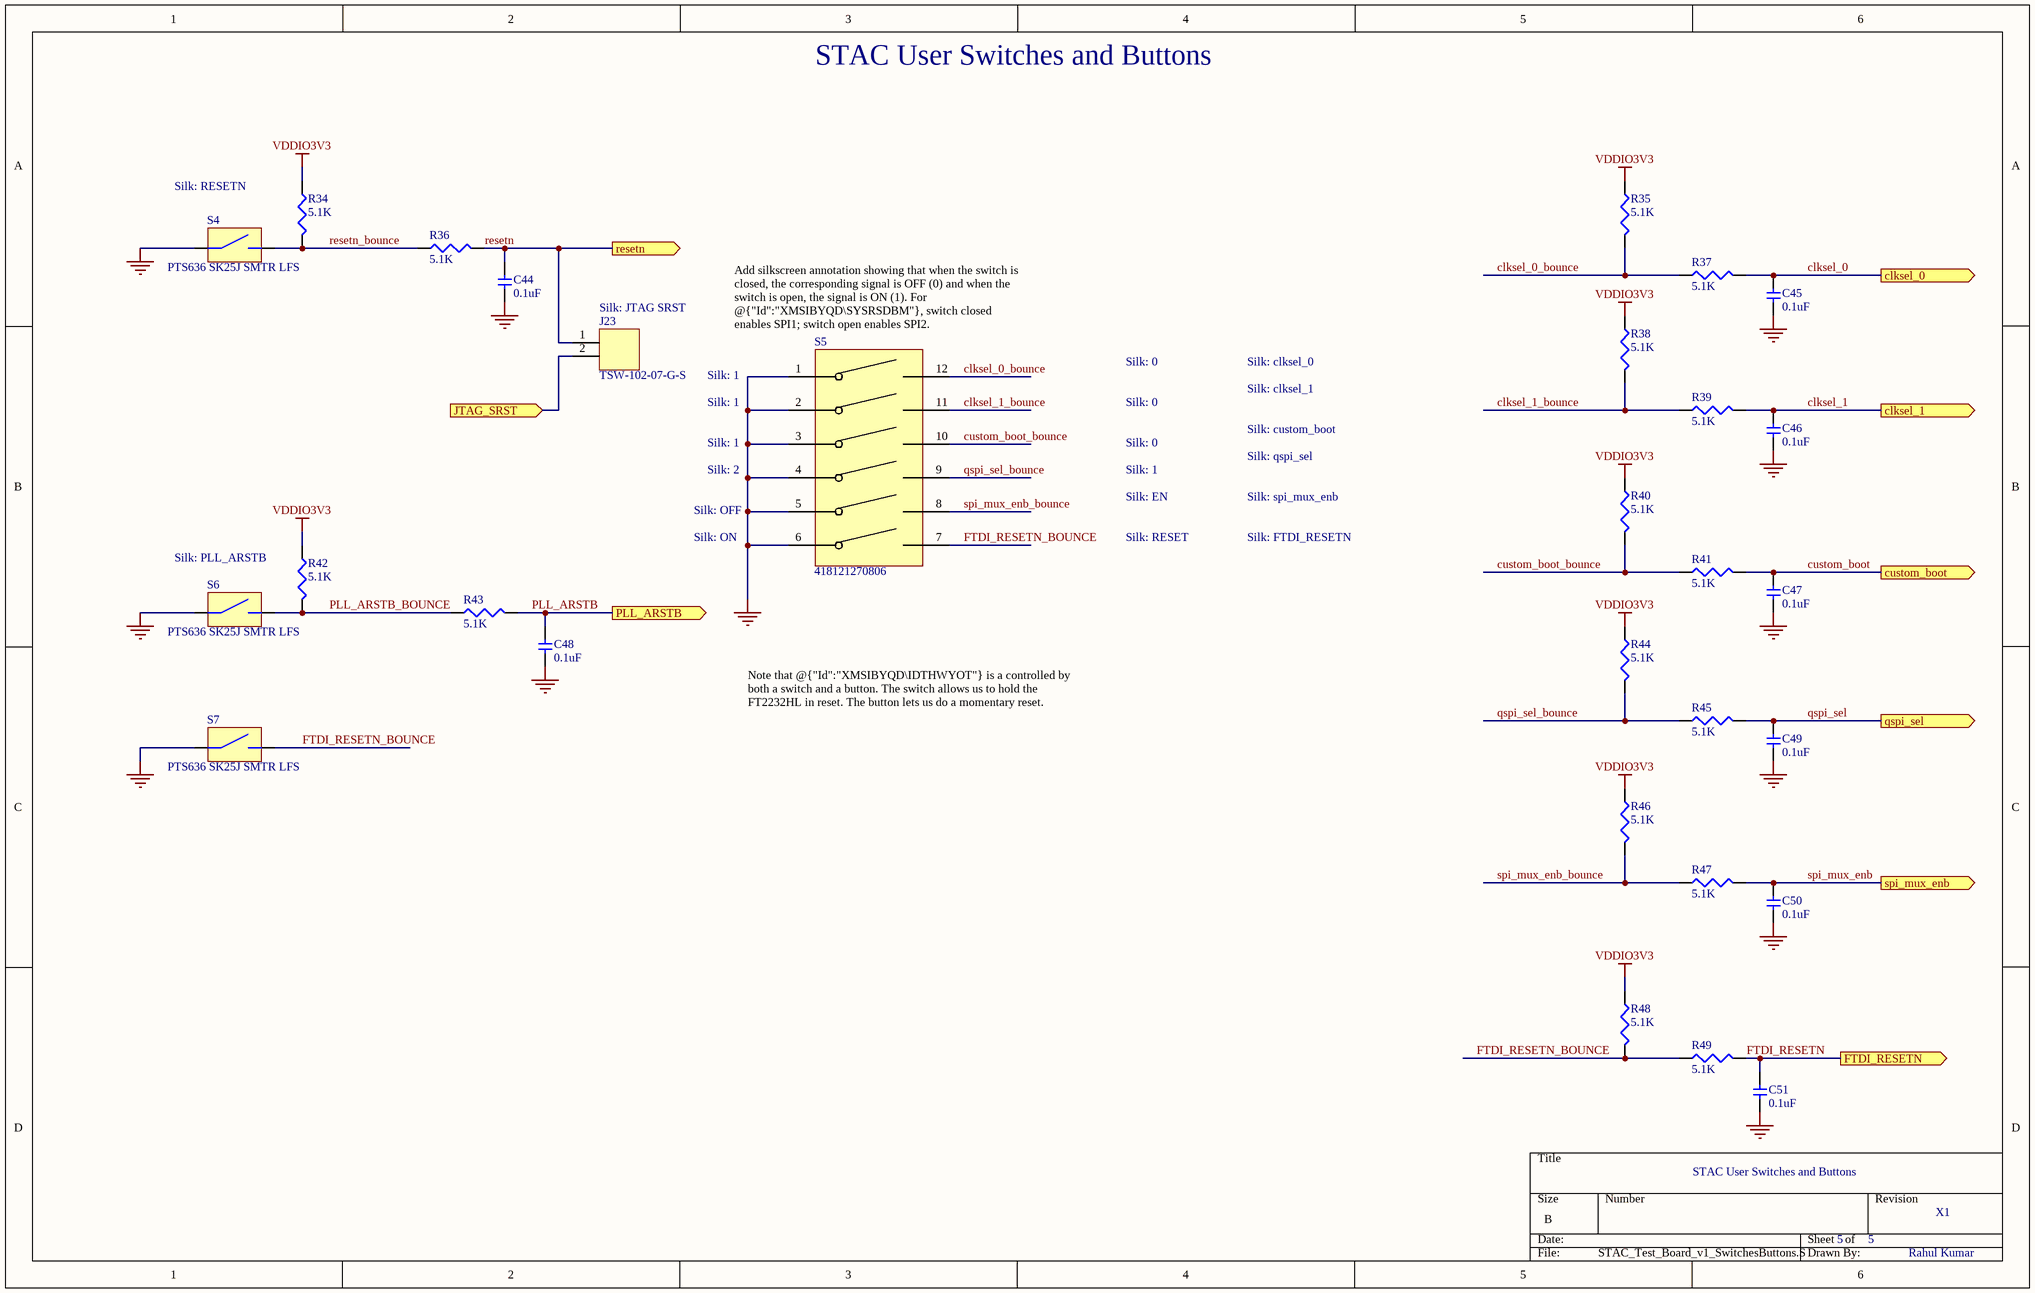
[diagram p4: STAC_Test_Board_v1_SwitchesButtons.SchDoc]

### Parts
C44  0.1uF  [0603]
C45  0.1uF  [0603]
C46  0.1uF  [0603]
C47  0.1uF  [0603]
C48  0.1uF  [0603]
C49  0.1uF  [0603]
C50  0.1uF  [0603]
C51  0.1uF  [0603]
J23  TSW-102-07-G-S  [CON-002-100-200X100/1X2-POST]
R34  5.1K  [0603]
R35  5.1K  [0603]
R36  5.1K  [0603]
R37  5.1K  [0603]
R38  5.1K  [0603]
R39  5.1K  [0603]
R40  5.1K  [0603]
R41  5.1K  [0603]
R42  5.1K  [0603]
R43  5.1K  [0603]
R44  5.1K  [0603]
R45  5.1K  [0603]
R46  5.1K  [0603]
R47  5.1K  [0603]
R48  5.1K  [0603]
R49  5.1K  [0603]
S4  PTS636 SK25J SMTR LFS  [SW-02-6.7X3.7]
S5  418121270806  [GW-12-100-390]
S6  PTS636 SK25J SMTR LFS  [SW-02-6.7X3.7]
S7  PTS636 SK25J SMTR LFS  [SW-02-6.7X3.7]

### Ports
clksel_0 (out, see STAC_Test_Board_v1[3D]), clksel_1 (out, see STAC_Test_Board_v1[3D]), custom_boot (out, see STAC_Test_Board_v1[3D]), FTDI_RESETN (out, see STAC_Test_Board_v1[3D], STAC_Test_Board_v1_USB[4B]), JTAG_SRST (in, see STAC_Test_Board_v1[3D], STAC_Test_Board_v1_USB[5B]), PLL_ARSTB (out, see STAC_Test_Board_v1[3D]), qspi_sel (out, see STAC_Test_Board_v1[3D], STAC_Test_Board_v1_QSPI[3B]), resetn (out, see STAC_Test_Board_v1[3D]), spi_mux_enb (out, see STAC_Test_Board_v1[3D], STAC_Test_Board_v1_QSPI[3B])

### Nets
GND: C44.2 C45.2 C46.2 C47.2 C48.2 C49.2 C50.2 C51.2 S4.2 S5.1 S5.2 S5.3 S5.4 S5.5 S5.6 S6.2 S7.2
VDDIO3V3: R34.1 R35.1 R38.1 R40.1 R42.1 R44.1 R46.1 R48.1
clksel_0: C45.1 R37.2 ; port clksel_0
clksel_0_bounce: R35.2 R37.1 S5.12
clksel_1: C46.1 R39.2 ; port clksel_1
clksel_1_bounce: R38.2 R39.1 S5.11
custom_boot: C47.1 R41.2 ; port custom_boot
custom_boot_bounce: R40.2 R41.1 S5.10
FTDI_RESETN: C51.1 R49.2 ; port FTDI_RESETN
FTDI_RESETN_BOUNCE: R48.2 R49.1 S5.7 S7.1
JTAG_SRST: J23.2 ; port JTAG_SRST
PLL_ARSTB: C48.1 R43.2 ; port PLL_ARSTB
PLL_ARSTB_BOUNCE: R42.2 R43.1 S6.1
qspi_sel: C49.1 R45.2 ; port qspi_sel
qspi_sel_bounce: R44.2 R45.1 S5.9
resetn: C44.1 J23.1 R36.2 ; port resetn
resetn_bounce: R34.2 R36.1 S4.1
spi_mux_enb: C50.1 R47.2 ; port spi_mux_enb
spi_mux_enb_bounce: R46.2 R47.1 S5.8

### Notes on the sheet
- Silk: RESETN
- (near J23) Silk: JTAG SRST
- (near S5) Add silkscreen annotation showing that when the switch is closed, the corresponding signal is OFF (0) and when the switch is open, the signal is ON (1). For @{"Id":"XMSIBYQD\SYSRSDBM"}, switch closed enables SPI1; switch open enables SPI2.
- Silk: 0
- Silk: clksel_0
- Silk: 1
- Silk: clksel_1
- Silk: custom_boot
- Silk: 2
- Silk: EN
- Silk: qspi_sel
- Silk: spi_mux_enb
- Silk: PLL_ARSTB
- Silk: OFF
- Silk: ON
- Silk: RESET
- Silk: FTDI_RESETN
- Note that @{"Id":"XMSIBYQD\IDTHWYOT"} is a controlled by both a switch and a button. The switch allows us to hold the FT2232HL in reset. The button lets us do a momentary reset.

### Library data of the parts
C44-C51 = DISCRETE_C: Capacitor generic
J23 = CON_002pin_1x2: Con 2 pins
R34-R49 = DISCRETE_R: Resistor generic
S4 S6 S7 = SWITCH_SPST_2pin: Switch 2 pins
S5 = SWITCH_SPST_x6: SWITCH DIP SPST x6

## Nets that join several sheets
5V: STAC_Test_Board_v1_Power (11 pins), STAC_Test_Board_v1_USB (J18.2)
GND: STAC_Test_Board_v1 (65 pins), STAC_Test_Board_v1_Power (62 pins), STAC_Test_Board_v1_USB (41 pins), STAC_Test_Board_v1_QSPI (12 pins), STAC_Test_Board_v1_SwitchesButtons (17 pins)
REG5V: STAC_Test_Board_v1_Power (6 pins), STAC_Test_Board_v1_USB (J18.3)
VDDD1V8: STAC_Test_Board_v1 (16 pins), STAC_Test_Board_v1_Power (R15.1 S1.2 T8.1)
VDDDEXT1V8: STAC_Test_Board_v1 (J7.1), STAC_Test_Board_v1_Power (C5.1 J1.3 S1.1)
VDDIO3V3: STAC_Test_Board_v1 (5 pins), STAC_Test_Board_v1_Power (R14.1 S2.2 T9.1), STAC_Test_Board_v1_USB (20 pins), STAC_Test_Board_v1_QSPI (12 pins), STAC_Test_Board_v1_SwitchesButtons (8 pins)
clksel_0: STAC_Test_Board_v1 (J12.5 U6.28), STAC_Test_Board_v1_SwitchesButtons (C45.1 R37.2)
clksel_1: STAC_Test_Board_v1 (J12.7 U6.41), STAC_Test_Board_v1_SwitchesButtons (C46.1 R39.2)
custom_boot: STAC_Test_Board_v1 (J12.9 U6.51), STAC_Test_Board_v1_SwitchesButtons (C47.1 R41.2)
FTDI_RESETN: STAC_Test_Board_v1 (J12.15), STAC_Test_Board_v1_USB (U7.14), STAC_Test_Board_v1_SwitchesButtons (C51.1 R49.2)
JTAG_SRST: STAC_Test_Board_v1 (J14.6), STAC_Test_Board_v1_USB (U7.27), STAC_Test_Board_v1_SwitchesButtons (J23.2)
JTAG_TCK: STAC_Test_Board_v1 (J14.5 U6.24), STAC_Test_Board_v1_USB (U7.16)
JTAG_TDI: STAC_Test_Board_v1 (J14.2 U6.26), STAC_Test_Board_v1_USB (U7.17)
JTAG_TDO: STAC_Test_Board_v1 (J14.1 U6.27), STAC_Test_Board_v1_USB (U7.18)
JTAG_TMS: STAC_Test_Board_v1 (J14.4 U6.25), STAC_Test_Board_v1_USB (U7.19)
PLL_ARSTB: STAC_Test_Board_v1 (J8.2 J12.1 U6.55), STAC_Test_Board_v1_SwitchesButtons (C48.1 R43.2)
qspi_sel: STAC_Test_Board_v1 (J12.11), STAC_Test_Board_v1_QSPI (U9.14 U9.24), STAC_Test_Board_v1_SwitchesButtons (C49.1 R45.2)
resetn: STAC_Test_Board_v1 (J12.3 U6.21), STAC_Test_Board_v1_SwitchesButtons (C44.1 J23.1 R36.2)
spi_0_cs_0: STAC_Test_Board_v1 (U6.33), STAC_Test_Board_v1_QSPI (J22.1 U9.12)
spi_0_dq_0: STAC_Test_Board_v1 (U6.37), STAC_Test_Board_v1_QSPI (J22.8 U9.4)
spi_0_dq_1: STAC_Test_Board_v1 (U6.36), STAC_Test_Board_v1_QSPI (J22.3 U9.6)
spi_0_dq_2: STAC_Test_Board_v1 (U6.35), STAC_Test_Board_v1_QSPI (J22.5 U9.7)
spi_0_dq_3: STAC_Test_Board_v1 (U6.34), STAC_Test_Board_v1_QSPI (J22.4 U9.9)
spi_0_sck: STAC_Test_Board_v1 (U6.32), STAC_Test_Board_v1_QSPI (J22.6 U9.10)
spi_mux_enb: STAC_Test_Board_v1 (J12.13), STAC_Test_Board_v1_QSPI (U9.20), STAC_Test_Board_v1_SwitchesButtons (C50.1 R47.2)
uart_0_rxd: STAC_Test_Board_v1 (J14.8 U6.8), STAC_Test_Board_v1_USB (U7.38)
uart_0_txd: STAC_Test_Board_v1 (J14.7 U6.7), STAC_Test_Board_v1_USB (U7.39)